# Altium schematic sheet Peripherals.SchDoc
size A3; SheetNumber: 7; SheetTotal: 6
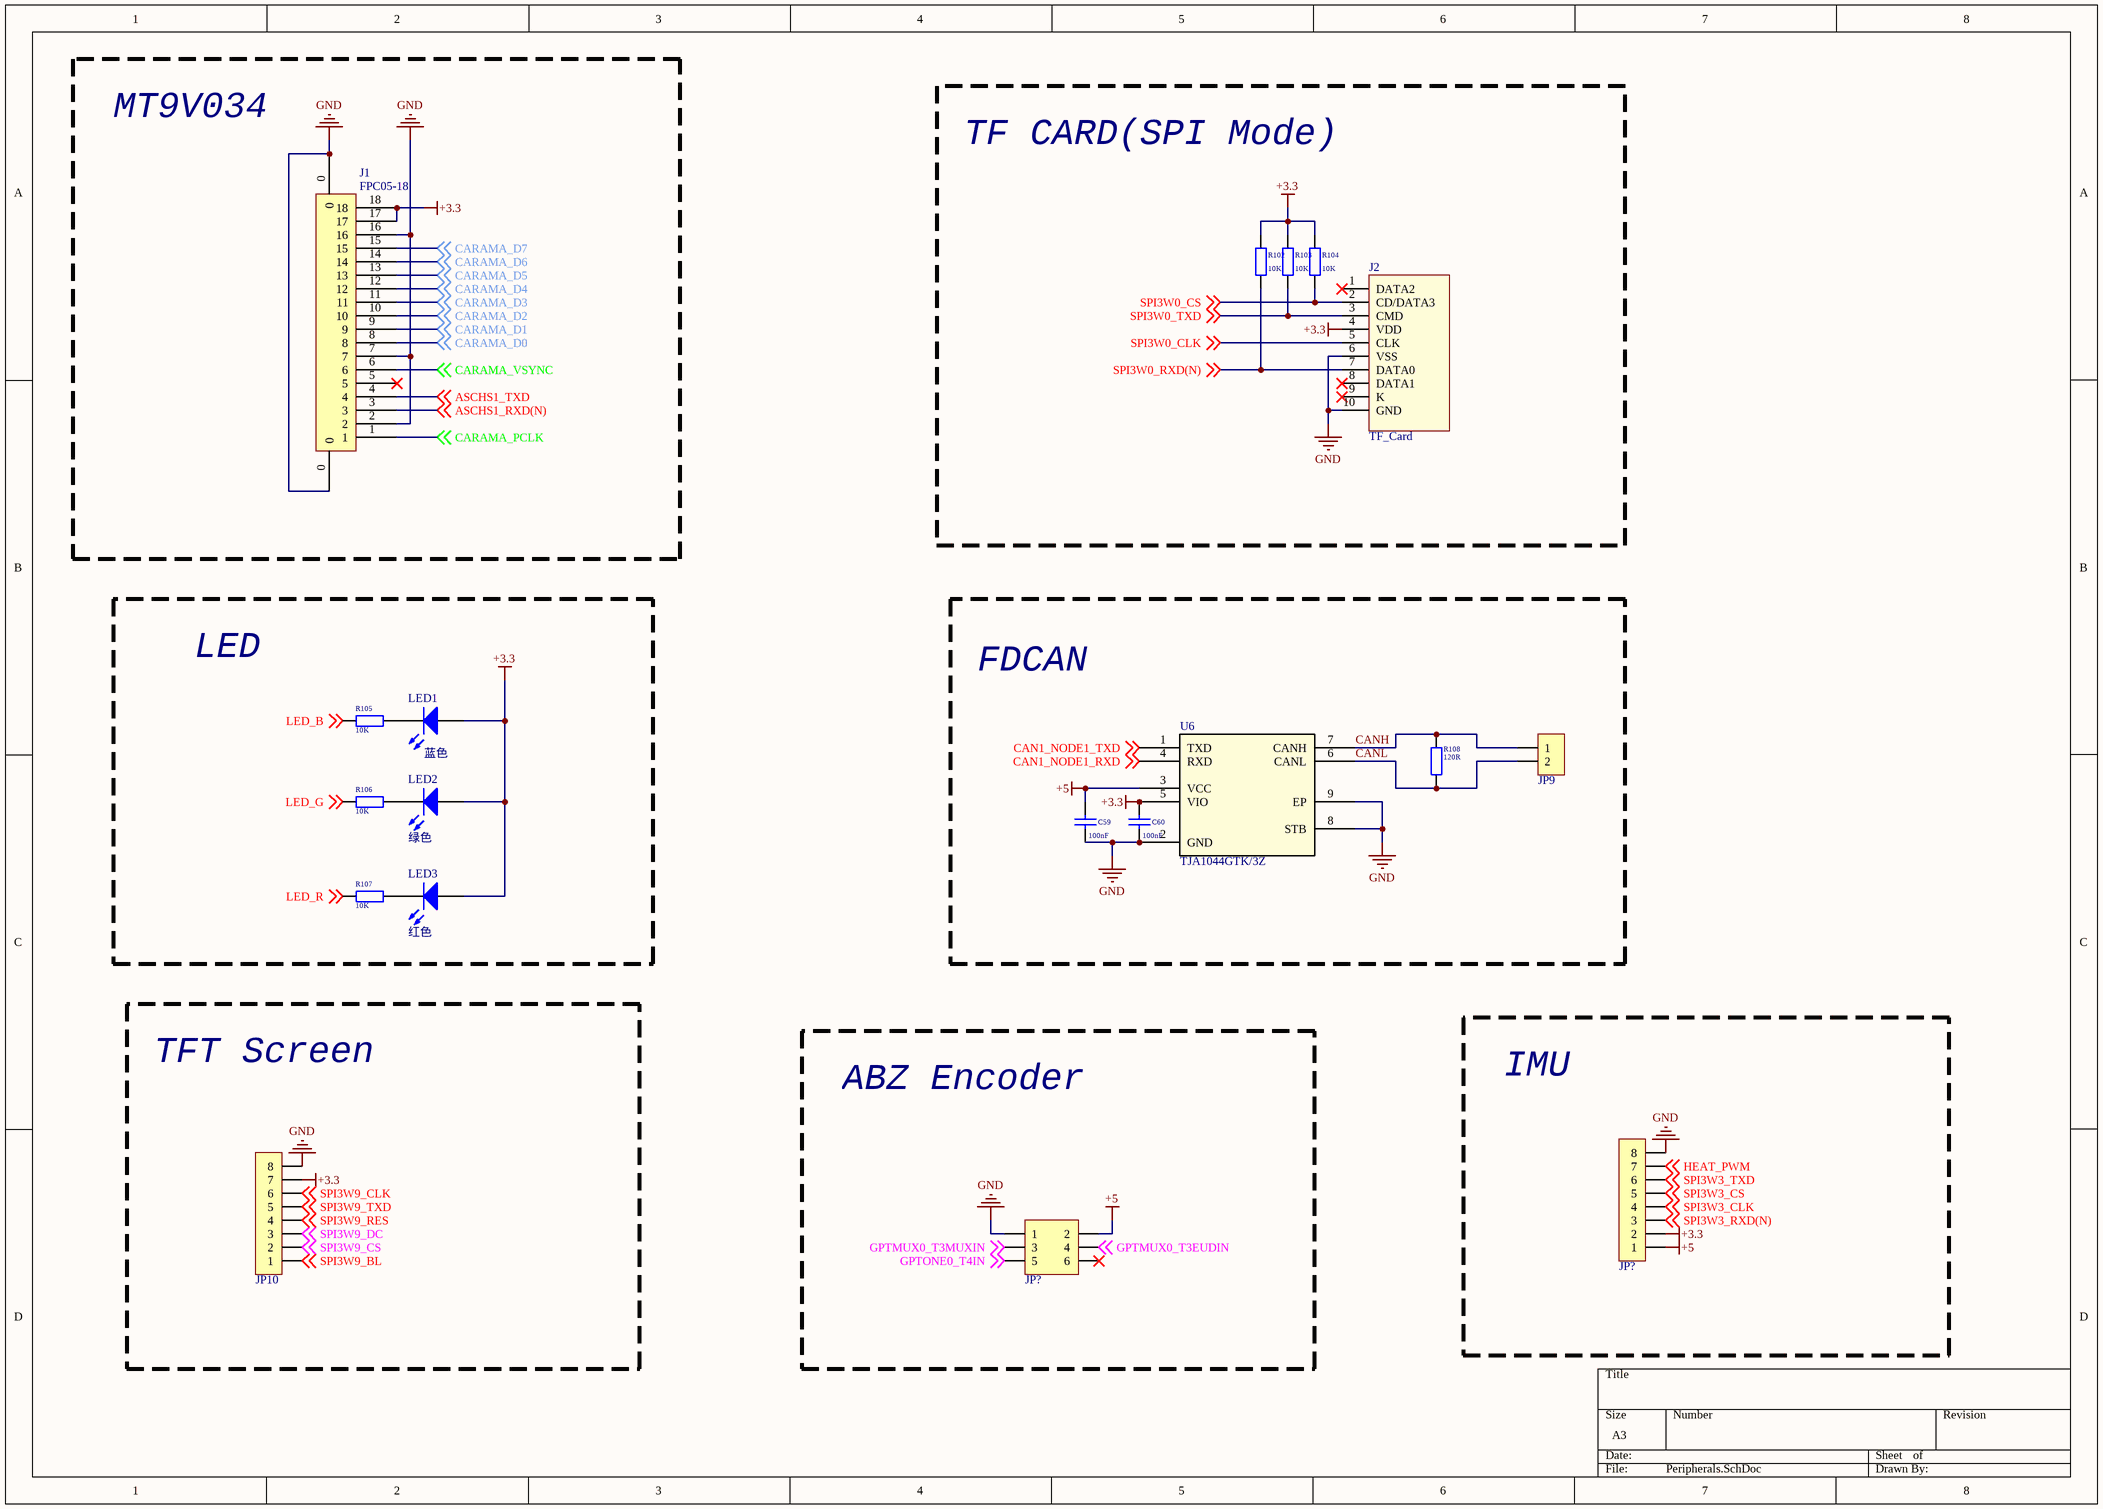
[diagram p0: Peripherals.SchDoc]

## Parts
(Parts that share a designator on the sheet are numbered #1, #2 ... from top to bottom, then left to right.)
C59  100nF  [C0402_L]
C60  100nF  [C0402_L]
J1  FPC05-18  [fpc_05_18p]
J2  TF_Card  [Micro SD]
JP9  HDR-1X2  [GH1.25-WT-2P]  (value not drawn)
JP10  HDR-1X8  [MX1.25-WT-8P]  (value not drawn)
JP?#1  Header3X2  [IDC2.54-LI-2x3P]  (value not drawn)
JP?#2  HDR-1X8  [MX1.25-WT-8P]  (value not drawn)
LED1  蓝色  [LED0402_B]
LED2  绿色  [LED0402_G]
LED3  红色  [LED0402_R]
R102  10K  [R0402_L]
R103  10K  [R0402_L]
R104  10K  [R0402_L]
R105  10K  [R0402_L]
R106  10K  [R0402_L]
R107  10K  [R0402_L]
R108  120R  [R0402_L]
U6  TJA1044GTK/3Z  [SON8_TJA1044GTK3Z_NXP]

## Blocks framed on the sheet
MT9V034: J1
TF CARD(SPI Mode): J2 R102-R104
LED: LED1-LED3 R105-R107
FDCAN: C59 C60 JP9 R108 U6
TFT Screen: JP10
ABZ Encoder: JP?#1
IMU: JP?#2

## Nets
+3.3: C60.2 J1.17 J1.18 J2.4(VDD) JP10.7 JP?#2.2 LED1.1(A) LED2.1(A) LED3.1(A) R102.2 R103.2 R104.2 U6.5(VIO)
+5: C59.2 JP?#1.2 JP?#2.1 U6.3(VCC)
GND: C59.1 C60.1 J1.0 J1.2 J1.7 J1.16 J2.6(VSS) J2.10(GND) JP10.8 JP?#1.1 JP?#2.8 U6.2(GND) U6.8(STB) U6.9(EP)
ASCHS1_RXD(N): J1.3 ; off-sheet ASCHS1_RXD(N)
ASCHS1_TXD: J1.4 ; off-sheet ASCHS1_TXD
CAN1_NODE1_RXD: U6.4(RXD) ; off-sheet CAN1_NODE1_RXD
CAN1_NODE1_TXD: U6.1(TXD) ; off-sheet CAN1_NODE1_TXD
CANH: JP9.1 R108.1 U6.7(CANH)
CANL: JP9.2 R108.2 U6.6(CANL)
CARAMA_D0: J1.8 ; off-sheet CARAMA_D0
CARAMA_D1: J1.9 ; off-sheet CARAMA_D1
CARAMA_D2: J1.10 ; off-sheet CARAMA_D2
CARAMA_D3: J1.11 ; off-sheet CARAMA_D3
CARAMA_D4: J1.12 ; off-sheet CARAMA_D4
CARAMA_D5: J1.13 ; off-sheet CARAMA_D5
CARAMA_D6: J1.14 ; off-sheet CARAMA_D6
CARAMA_D7: J1.15 ; off-sheet CARAMA_D7
CARAMA_PCLK: J1.1 ; off-sheet CARAMA_PCLK
CARAMA_VSYNC: J1.6 ; off-sheet CARAMA_VSYNC
GPTMUX0_T3EUDIN: JP?#1.4 ; off-sheet GPTMUX0_T3EUDIN
GPTMUX0_T3MUXIN: JP?#1.3 ; off-sheet GPTMUX0_T3MUXIN
GPTONE0_T4IN: JP?#1.5 ; off-sheet GPTONE0_T4IN
HEAT_PWM: JP?#2.7 ; off-sheet HEAT_PWM
LED_B: R105.2 ; off-sheet LED_B
LED_G: R106.2 ; off-sheet LED_G
LED_R: R107.2 ; off-sheet LED_R
SPI3W0_CLK: J2.5(CLK) ; off-sheet SPI3W0_CLK
SPI3W0_CS: J2.2(CD/DATA3) R104.1 ; off-sheet SPI3W0_CS
SPI3W0_RXD(N): J2.7(DATA0) R102.1 ; off-sheet SPI3W0_RXD(N)
SPI3W0_TXD: J2.3(CMD) R103.1 ; off-sheet SPI3W0_TXD
SPI3W3_CLK: JP?#2.4 ; off-sheet SPI3W3_CLK
SPI3W3_CS: JP?#2.5 ; off-sheet SPI3W3_CS
SPI3W3_RXD(N): JP?#2.3 ; off-sheet SPI3W3_RXD(N)
SPI3W3_TXD: JP?#2.6 ; off-sheet SPI3W3_TXD
SPI3W9_BL: JP10.1 ; off-sheet SPI3W9_BL
SPI3W9_CLK: JP10.6 ; off-sheet SPI3W9_CLK
SPI3W9_CS: JP10.2 ; off-sheet SPI3W9_CS
SPI3W9_DC: JP10.3 ; off-sheet SPI3W9_DC
SPI3W9_RES: JP10.4 ; off-sheet SPI3W9_RES
SPI3W9_TXD: JP10.5 ; off-sheet SPI3W9_TXD
NetLED1_2: LED1.2(K) R105.1
NetLED2_2: LED2.2(K) R106.1
NetLED3_2: LED3.2(K) R107.1

Not connected (* = marked no-connect by the designer): J1 5*; J2 1(DATA2)* 8(DATA1)* 9(K)*; JP?#1 6*

## Library data of the parts
C59 C60 = CMP-002-000000-1: 贴片电容/MLCC电容; BOM名称: 无极性贴片电容; 当前库版本V2023.5.31 @淘宝卖家:黄晶宝石: 最新版本发布https://item.taobao.com/item.htm?id=566775463719; Design Item ID: C; Source: 0.1 - 电阻-电容-电感-保险丝-晶振-晶体-磁珠-电位器-法拉电容-馈通电容.SchLib
J2 = TF_Card: TF卡座; 当前库版本V2023.5.31 @淘宝卖家:黄晶宝石: 最新版本发布https://shop463601444.taobao.com; BOM名称: TF卡座
JP9 = Header 2: 2P连接器; 联系卖家 免费技术支持: 封装库来自淘宝卖家ID：黄晶宝石; BOM名称: 2P连接器
JP10 JP?#2 = Header 8: 8P连接器; 联系卖家 免费技术支持: 封装库来自淘宝卖家ID：黄晶宝石; BOM名称: 8P连接器
JP?#1 = Header 3X2: 3*2P接插件; 联系卖家，免费查找封装: 唯一出售店铺网址https://shop463601444.taobao.com; 封装库来自淘宝卖家ID：黄晶宝石: 其他店铺购入均为盗版封装库，请立即申请退款，本店现金奖励50~200元; BOM名称: 3*2P接插件
LED1-LED3 = LED: 贴片LED; 封装库来自淘宝卖家：黄晶宝石: 其他店铺购入均为盗版封装库，无更新权益，请立即申请退款，本店现金奖励200~1000元; BOM名称: 贴片LED
R102-R108 = CMP-005-000000-2: 贴片电阻0; 联系下单店铺卖家 免费帮你查找封装: 联系下单店铺卖家 免费技术支持; BOM名称: 贴片电阻; Source: 0.1 - 电阻-电容-电感-保险丝-晶振-晶体-磁珠-电位器-法拉电容-馈通电容.SchLib; Design Item ID: R
U6 = CMP-00028-4: CAN High Speed Transceiver 1Mbps Normal/Standby 4.75V to 5.25V 8-Pin HVSON T/R